# Altium schematic sheet DDMTD.SchDoc: Sayma AMC
size 420 x 297 mm; CheckedBy: P.Kulik,T.Przywozki,W.Ruclo; Author: G.Kasprowicz; CompanyName: WUT ISE; DrawnBy: G.Kasprowicz; Organization: WUT ISE; Address1: PW ISE; Address2: Nowowiejska 15/19 00-665 Warsaw; Address3: gkasprow@gmail.com; DocumentNumber: 18; Revision: 2; SheetNumber: 18; SheetTotal: 29; ModifiedBy: -; CheckedDate: -; Title2: WR DDMTD; DivGrp: WUT ISE; Designer: G.Kasprowicz; ModifiedDate: -; ProjectName: Sensor Box
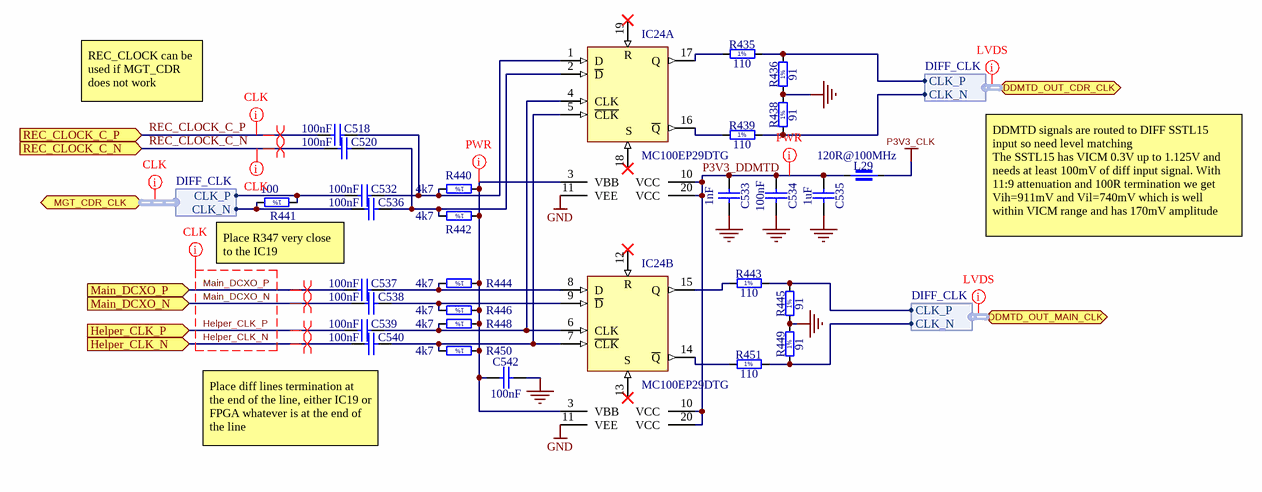
[diagram p0: DDMTD.SchDoc]

## Parts
C518  100nF  [CAPC1005X55N]
C520  100nF  [CAPC1005X55N]
C532  100nF  [CAPC1005X55N]
C533  1nF  [CAPC0603X33N]
C534  100nF  [CAPC0603X33N]
C535  1uF  [CAPC1005X55N]
C536  100nF  [CAPC1005X55N]
C537  100nF  [CAPC1005X55N]
C538  100nF  [CAPC1005X55N]
C539  100nF  [CAPC1005X55N]
C540  100nF  [CAPC1005X55N]
C542  100nF  [CAPC0603X33N]
IC24  MC100EP29DTG  [SOP65P640X120-20N]  (parts A,B of 2)
L29  120R@100MHz  [INDC1608X95N]
R435  110  [RESC1005X40N]
R436  91  [RESC1005X40N]
R438  91  [RESC1005X40N]
R439  110  [RESC1005X40N]
R440  4k7  [RESC1005X40N]
R441  100  [RESC1005X40N]
R442  4k7  [RESC1005X40N]
R443  110  [RESC1005X40N]
R444  4k7  [RESC1005X40N]
R445  91  [RESC1005X40N]
R446  4k7  [RESC1005X40N]
R448  4k7  [RESC1005X40N]
R449  91  [RESC1005X40N]
R450  4k7  [RESC1005X40N]
R451  110  [RESC1005X40N]

## Ports
DDMTD_OUT_CDR_CLK (bidir, harness DIFF_CLK), DDMTD_OUT_MAIN_CLK (bidir, harness DIFF_CLK), Helper_CLK_N (in), Helper_CLK_P (in), Main_DCXO_N (in), Main_DCXO_P (in), MGT_CDR_CLK (bidir, harness DIFF_CLK), REC_CLOCK_C_N (in), REC_CLOCK_C_P (in)

## Harnesses
DIFF_CLK: CLK_N, CLK_P

## Nets
GND: C533.1 C534.1 C535.2 C542.1 IC24.11(VEE) R436.1 R438.2 R445.1 R449.2
P3V3_CLK: L29.1
Helper_CLK_N: C540.1 ; port Helper_CLK_N
Helper_CLK_P: C539.1 ; port Helper_CLK_P
Main_DCXO_N: C538.1 ; port Main_DCXO_N
Main_DCXO_P: C537.1 ; port Main_DCXO_P
P3V3_DDMTD: C533.2 C534.2 C535.1 IC24.10(VCC) IC24.20(VCC) L29.2
REC_CLOCK_C_N: C520.1 ; port REC_CLOCK_C_N
REC_CLOCK_C_P: C518.1 ; port REC_CLOCK_C_P
NetC518_2: C518.2 C532.2 IC24.1(D) R440.2
NetC520_2: C520.2 C536.2 IC24.2(~{D}) R442.2
NetC532_1: C532.1 R441.1 ; port MGT_CDR_CLK.CLK_P
NetC536_1: C536.1 R441.2 ; port MGT_CDR_CLK.CLK_N
NetC537_2: C537.2 IC24.8(D) R444.2
NetC538_2: C538.2 IC24.9(~{D}) R446.2
NetC539_2: C539.2 IC24.4(CLK) IC24.6(CLK) R448.2
NetC540_2: C540.2 IC24.5(~{CLK}) IC24.7(~{CLK}) R450.2
NetC542_2: C542.2 IC24.3(VBB) R440.1 R442.1 R444.1 R446.1 R448.1 R450.1
NetIC24_14: IC24.14(~{Q}) R451.1
NetIC24_15: IC24.15(Q) R443.1
NetIC24_16: IC24.16(~{Q}) R439.1
NetIC24_17: IC24.17(Q) R435.1
NetR435_2: R435.2 R436.2 ; port DDMTD_OUT_CDR_CLK.CLK_P
NetR438_1: R438.1 R439.2 ; port DDMTD_OUT_CDR_CLK.CLK_N
NetR443_2: R443.2 R445.2 ; port DDMTD_OUT_MAIN_CLK.CLK_P
NetR449_1: R449.1 R451.2 ; port DDMTD_OUT_MAIN_CLK.CLK_N

Not connected (* = marked no-connect by the designer): IC24 12(R)* 13(S)* 18(S)* 19(R)*

## Layout directives
differential pair: Helper_CLK_N, Helper_CLK_P, Main_DCXO_N, Main_DCXO_P, REC_CLOCK_C_N, REC_CLOCK_C_P
net class CLK: (no net found under the mark), Helper_CLK_N, Helper_CLK_P, Main_DCXO_N, Main_DCXO_P, REC_CLOCK_C_N, REC_CLOCK_C_P
net class LVDS: (no net found under the mark)
net class PWR: NetC542_2, P3V3_DDMTD

## Notes on the sheet
- REC_CLOCK can be used if MGT_CDR does not work
- DDMTD signals are routed to DIFF SSTL15 input so need level matching
  The SSTL15 has VICM 0.3V up to 1.125V and needs at least 100mV of diff input signal. With 11:9 attenuation and 100R termination we get Vih=911mV and Vil=740mV which is well within VICM range and has 170mV amplitude
- Place R347 very close  to the IC19
- Place diff lines termination at the end of the line, either IC19 or FPGA whatever is at the end of the line
- Project/Equipment
- Document
- Designer
- Drawn by
- Check.by
- Copyright WUT ISE 2018.
  This documentation describes Open Hardware and is licensed under the CERN OHL v.1.1. You may redistribute and modify this documentation under the terms of the CERN OHL v.1.1. (http://ohwr.org/CERNOHL). This documentation is distributed WITHOUT ANY EXPRESS OR IMPLIED WARRANTY, INCLUDING OF MERCHANTABILITY, SATISFACTORY QUALITY AND FITNESS FOR A PARTICULAR PURPOSE. Please see the CERN OHL v.1.1 for applicable conditions.
- Contact
- File
- Last Mod.
- Print Date
- Sheet
- Size
- A3
- of
- Rev
- (in symbol R0402_4K7_1%_0.0625W_100PPM) 1%
- (in symbol R0402_91R_1%_0.0625W_100PPM) 1%
- (in symbol R0402_100R_1%_0.0625W_100PPM) 1%
- (in symbol R0402_110R_1%_0.0625W_100PPM) 1%

## Library data of the parts
C518 C520 C532 C536-C540 = CC0402_100NF_16V_10%_X5R: Non-polarised capacitor; Manufacturer: GENERIC; Manufacturer1 Part Number: GRM155R61C104KA88D; Part Description: SMD Multilayer Chip Ceramic Capacitor; TC: X5R; Tolerance: ±10%; Voltage: 16V; Case: 0402; Manufacturer Part Number: CC0402_100NF_16V_10%_X5R; Manufacturer1 Example: MURATA; Part Number: CC0402_100NF_16V_10%_X5R; Pin Count: 2; SMD: Yes; Status: None; Value: 100nF; Component Kind: Standard; Component Type: Standard; Mounted: Yes; Socket: No; Sense: No; Manufacturer1 ComponentHeight: 0.55mm; HelpURL: \\cern.ch\dfs\Applications\Altium\Datasheets\CC0402_X5R_MURATA_GRM.pdf; Author: CERN DEM JLC; CreateDate: 10.12.2013; LatestRevisionDate: 10.12.2013
C533 = CC0201_1NF_16V_10%_X5R: Non-polarised capacitor; Manufacturer: GENERIC; Part Description: SMD Multilayer Chip Ceramic Capacitor; Manufacturer1 Part Number: 0201YD102KAT2A; Tolerance: ±10%; Voltage: 16V; TC: X5R; Manufacturer Part Number: CC0201_1NF_16V_10%_X5R; Part Number: CC0201_1NF_16V_10%_X5R; Value: 1nF; Component Kind: Standard; Component Type: Standard; Pin Count: 2; Status: Not Recommended; Case: 0201; Mounted: Yes; Socket: No; SMD: Yes; Sense: No; Manufacturer1 Example: AVX; Manufacturer1 ComponentHeight: 0.33mm; HelpURL: \\cern.ch\dfs\Applications\Altium\Datasheets\CC0201_X5R_AVX.pdf; Author: CERN DEM JLC; CreateDate: 03.12.2007; LatestRevisionDate: 03.12.2007
C534 C542 = CC0201_100NF_6.3V_10%_X5R: Non-polarised capacitor; Manufacturer: GENERIC; Part Description: SMD Multilayer Chip Ceramic Capacitor; Manufacturer1 Part Number: 02016D104KAT2A; Tolerance: ±10%; Voltage: 6.3V; TC: X5R; Manufacturer Part Number: CC0201_100NF_6.3V_10%_X5R; Part Number: CC0201_100NF_6.3V_10%_X5R; Value: 100nF; Component Kind: Standard; Component Type: Standard; Pin Count: 2; Status: Not Recommended; Case: 0201; Mounted: Yes; Socket: No; SMD: Yes; Sense: No; Manufacturer1 Example: AVX; Manufacturer1 ComponentHeight: 0.33mm; HelpURL: \\cern.ch\dfs\Applications\Altium\Datasheets\CC0201_X5R_AVX.pdf; Author: CERN DEM JLC; CreateDate: 03.12.2007; LatestRevisionDate: 03.12.2007
C535 = CC0402_1UF_16V_10%_X5R: Non-polarised capacitor; Manufacturer: GENERIC; Part Description: SMD Multilayer Chip Ceramic Capacitor; Manufacturer1 Part Number: C1005X5R1C105KT; Tolerance: ±10%; Voltage: 16V; TC: X5R; Manufacturer Part Number: CC0402_1UF_16V_10%_X5R; Part Number: CC0402_1UF_16V_10%_X5R; Value: 1uF; Component Kind: Standard; Component Type: Standard; Pin Count: 2; Status: Preferred; Case: 0402; Mounted: Yes; Socket: No; SMD: Yes; Sense: No; Manufacturer1 Example: TDK; Manufacturer1 ComponentHeight: 0.55mm; HelpURL: \\cern.ch\dfs\Applications\Altium\Datasheets\CC0402_X5R_TDK_C.pdf; Author: CERN DEM JLC; CreateDate: 25.10.2012; LatestRevisionDate: 25.10.2012
IC24 = MC100EP29DTG: 3.3V/5V ECL Dual Differential Data and Clock D Flip-Flop With Set and Reset; Manufacturer: ON SEMICONDUCTOR; PressFit: No; Bonding: No; Part Number: MC100EP29DTG; Component Kind: Standard; Component Type: Standard; Device: MC100EP29DTG; PackageDescription: SOP, 20-Leads, Body 6.5x4.4mm, Pitch 0.65mm, IPC Medium Density; Part Description: 3.3V/5V ECL Dual Differential Data And Clock D Flip-Flop With Set and Reset; Manufacturer Part Number: MC100EP29DTG; Pin Count: 20; Case: TSSOP20; Mounted: Yes; Socket: No; SMD: Yes; Sense: No; ComponentHeight: 1.2mm; Author: CERN DEM JLC; HelpURL: \\cern.ch\dfs\Applications\Altium\Datasheets\MC100EP29DTG.pdf; CreateDate: 12.01.2011; LatestRevisionDate: 12.01.2011
L29 = IND0603_MURATA_BLM18PG121SN1D: Manufacturer: MURATA; Part Description: SMD EMIFIL Chip Ferrite Bead; Power: 2A; Resistance: 0.05R; Manufacturer Part Number: BLM18PG121SN1D; Part Number: IND0603_MURATA_BLM18PG121SN1D; Value: 120R@100MHz; Component Kind: Standard; Component Type: Standard; Pin Count: 2; Status: None; Case: 0603; Mounted: Yes; Socket: No; SMD: Yes; Sense: No; ComponentHeight: 0.95mm; HelpURL: \\cern.ch\dfs\Applications\Altium\Datasheets\IND0603_MURATA_BLM18P.pdf; Author: CERN DEM BC; CreateDate: 27.07.2015; LatestRevisionDate: 25.10.2018
R435 R439 R443 R451 = R0402_110R_1%_0.0625W_100PPM: Resistor - 1%; Manufacturer: GENERIC; Part Description: General Purpose Thick Film Chip Resistor; Manufacturer1 Part Number: 232270671101L; TC: ±100ppm/°C; PressFit: No; Manufacturer Part Number: R0402_110R_1%_0.0625W_100PPM; Part Number: R0402_110R_1%_0.0625W_100PPM; Tolerance: ±1%; Value: 110; Component Kind: Standard; Component Type: Standard; Pin Count: 2; Status: Not Recommended; Power: 0.0625W; Case: 0402; Mounted: Yes; Sense: No; Socket: No; SMD: Yes; Manufacturer1 Example: YAGEO PHYCOMP; Manufacturer1 ComponentHeight: 0.4mm; HelpURL: \\cern.ch\dfs\Applications\Altium\Datasheets\R0402_Phycomp_RC0402.pdf; Author: CERN DEM JLC; CreateDate: 03.12.2007; LatestRevisionDate: 17.10.2012
R436 R438 R445 R449 = R0402_91R_1%_0.0625W_100PPM: Resistor - 1%; Manufacturer: GENERIC; Part Description: General Purpose Thick Film Chip Resistor; Manufacturer1 Part Number: 232270679109L; TC: ±100ppm/°C; PressFit: No; Manufacturer Part Number: R0402_91R_1%_0.0625W_100PPM; Part Number: R0402_91R_1%_0.0625W_100PPM; Tolerance: ±1%; Value: 91; Component Kind: Standard; Component Type: Standard; Pin Count: 2; Status: Not Recommended; Power: 0.0625W; Case: 0402; Mounted: Yes; Sense: No; Socket: No; SMD: Yes; Manufacturer1 Example: YAGEO PHYCOMP; Manufacturer1 ComponentHeight: 0.4mm; HelpURL: \\cern.ch\dfs\Applications\Altium\Datasheets\R0402_Phycomp_RC0402.pdf; Author: CERN DEM JLC; CreateDate: 03.12.2007; LatestRevisionDate: 17.10.2012
R440 R442 R444 R446 R448 R450 = R0402_4K7_1%_0.0625W_100PPM: Resistor - 1%; Manufacturer: GENERIC; Part Description: General Purpose Thick Film Chip Resistor; Manufacturer1 Part Number: 232270674702L; TC: ±100ppm/°C; PressFit: No; Manufacturer Part Number: R0402_4K7_1%_0.0625W_100PPM; Part Number: R0402_4K7_1%_0.0625W_100PPM; Tolerance: ±1%; Value: 4k7; Component Kind: Standard; Component Type: Standard; Pin Count: 2; Status: Not Recommended; Power: 0.0625W; Case: 0402; Mounted: Yes; Sense: No; Socket: No; SMD: Yes; Manufacturer1 Example: YAGEO PHYCOMP; Manufacturer1 ComponentHeight: 0.4mm; HelpURL: \\cern.ch\dfs\Applications\Altium\Datasheets\R0402_Phycomp_RC0402.pdf; Author: CERN DEM JLC; CreateDate: 03.12.2007; LatestRevisionDate: 17.10.2012
R441 = R0402_100R_1%_0.0625W_100PPM: Resistor - 1%; Manufacturer: GENERIC; Part Description: General Purpose Thick Film Chip Resistor; Manufacturer1 Part Number: 232270671001L; TC: ±100ppm/°C; PressFit: No; Manufacturer Part Number: R0402_100R_1%_0.0625W_100PPM; Part Number: R0402_100R_1%_0.0625W_100PPM; Tolerance: ±1%; Value: 100; Component Kind: Standard; Component Type: Standard; Pin Count: 2; Status: Not Recommended; Power: 0.0625W; Case: 0402; Mounted: Yes; Sense: No; Socket: No; SMD: Yes; Manufacturer1 Example: YAGEO PHYCOMP; Manufacturer1 ComponentHeight: 0.4mm; HelpURL: \\cern.ch\dfs\Applications\Altium\Datasheets\R0402_Phycomp_RC0402.pdf; Author: CERN DEM JLC; CreateDate: 03.12.2007; LatestRevisionDate: 17.10.2012